# Altium schematic sheet IFCS-MAIN_V1.11_IFCS-MAIN_V1.1.schdoc
size 543 x 365 mm; Name: D:\【天成消防】\Altium Designer Ku\原理图模板\A1模板 -1.SchDot; Symbol: D:\【天成消防】\Altium Designer Ku\原理图模板\A1模板 -1.SchDot; Device: D:\【天成消防】\Altium Designer Ku\原理图模板\A1模板 -1.SchDot; Width: 2100; Height: 1400; X Region Count: 12; Y Region Count: 4; Blade Width: 30; Region Start: 1; Title Block Position: 3
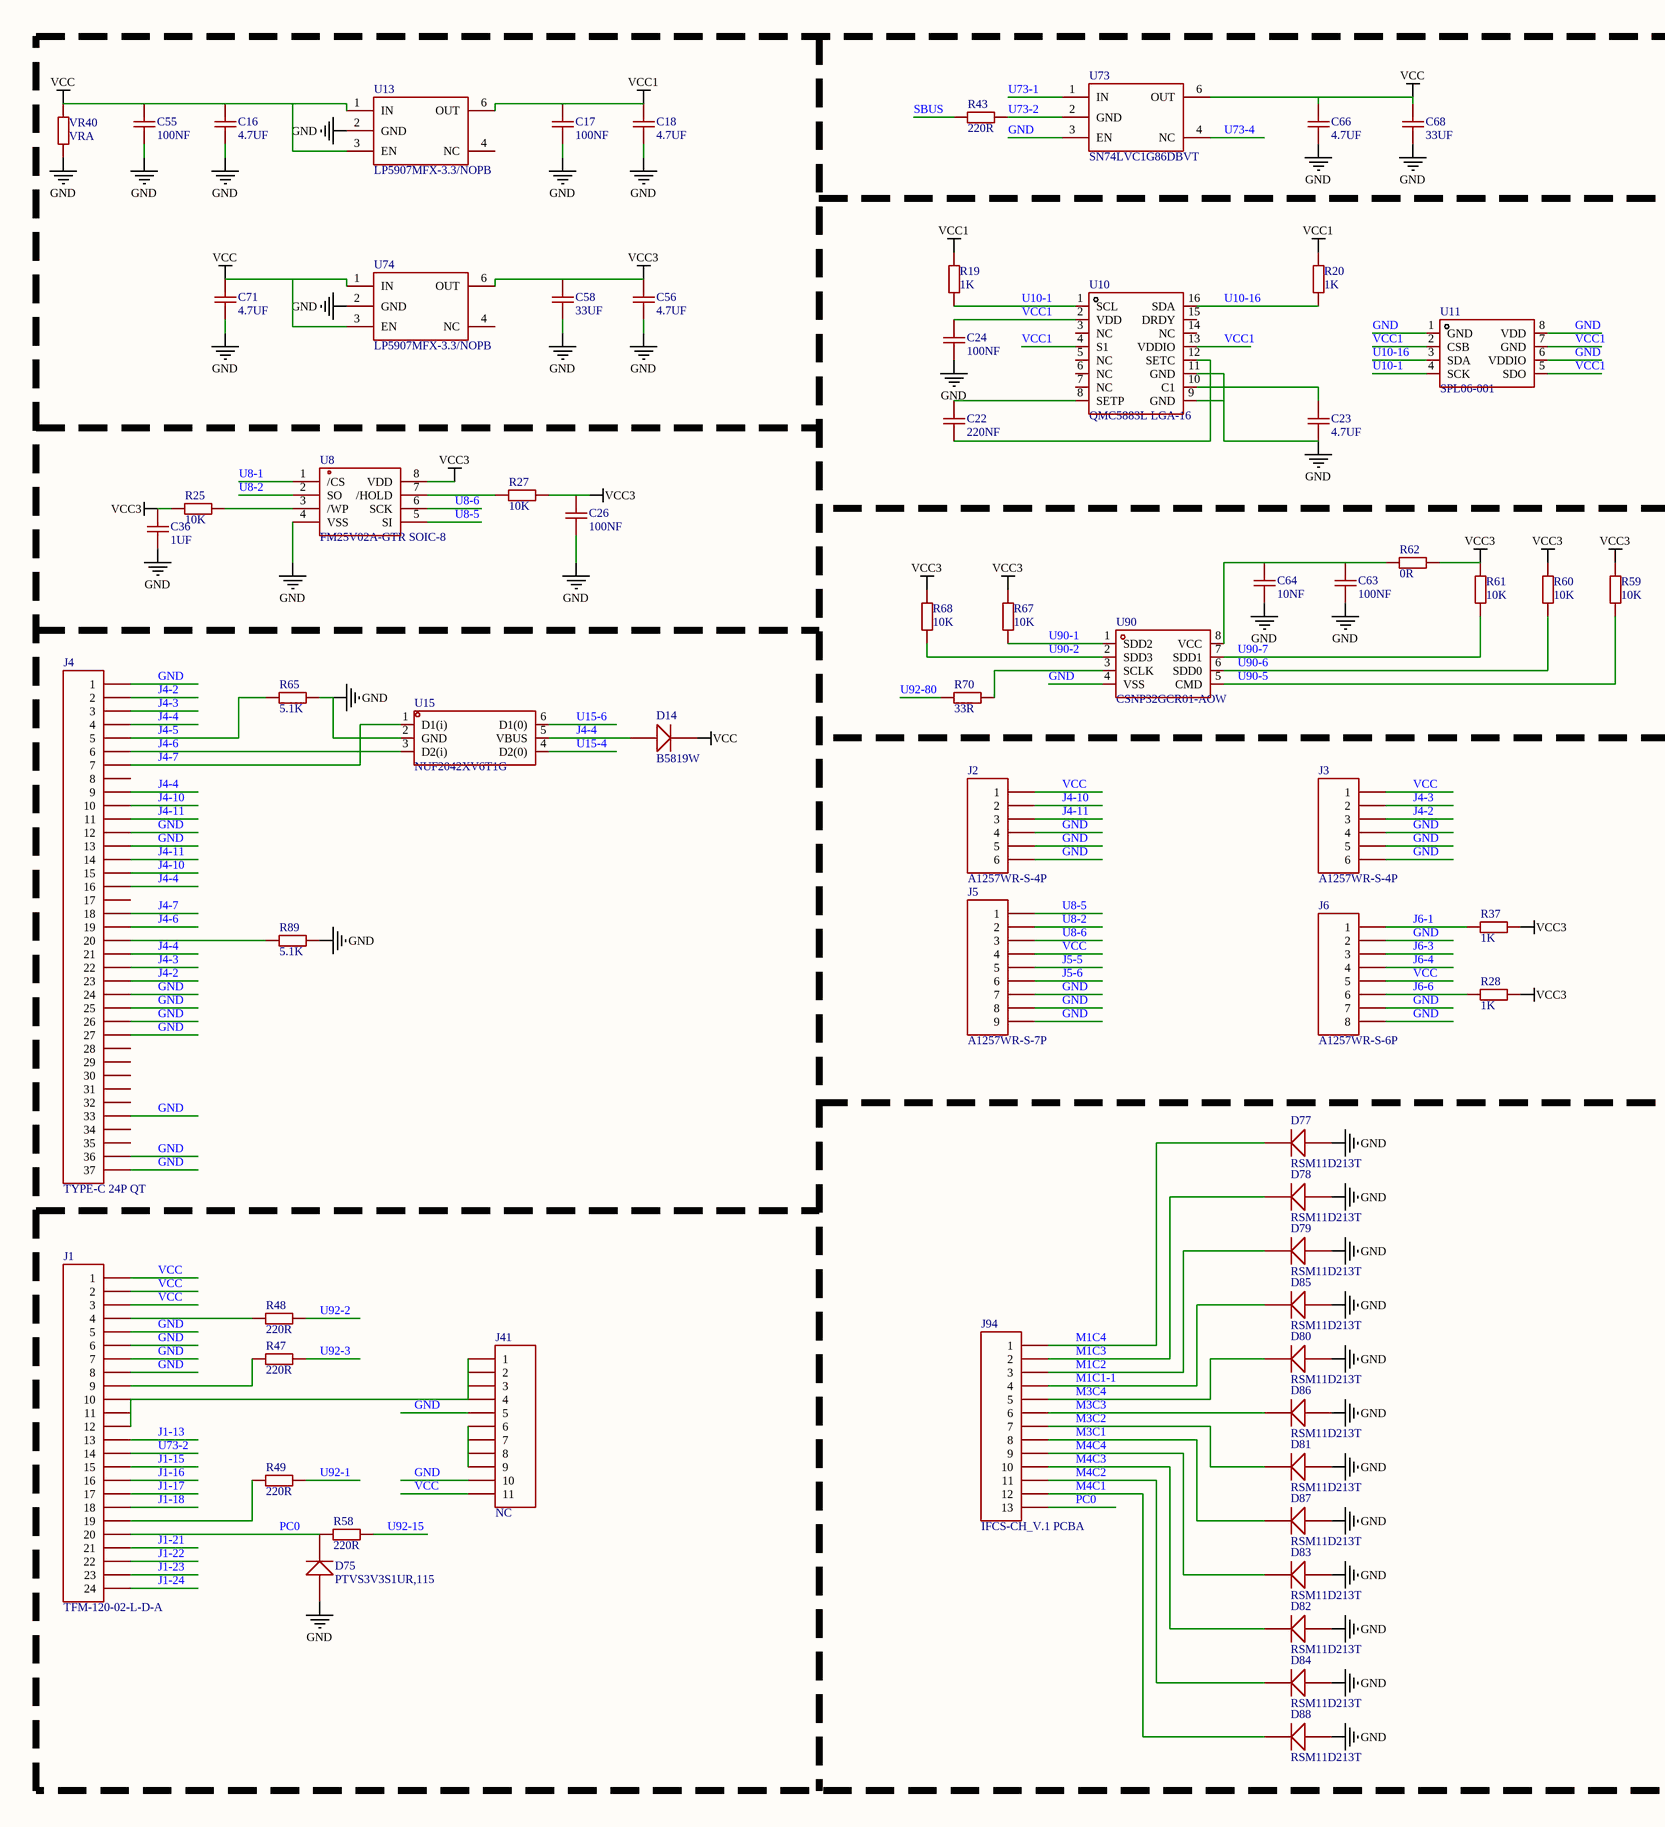
[diagram p0: IFCS-MAIN_V1.11_IFCS-MAIN_V1.1.schdoc, left]
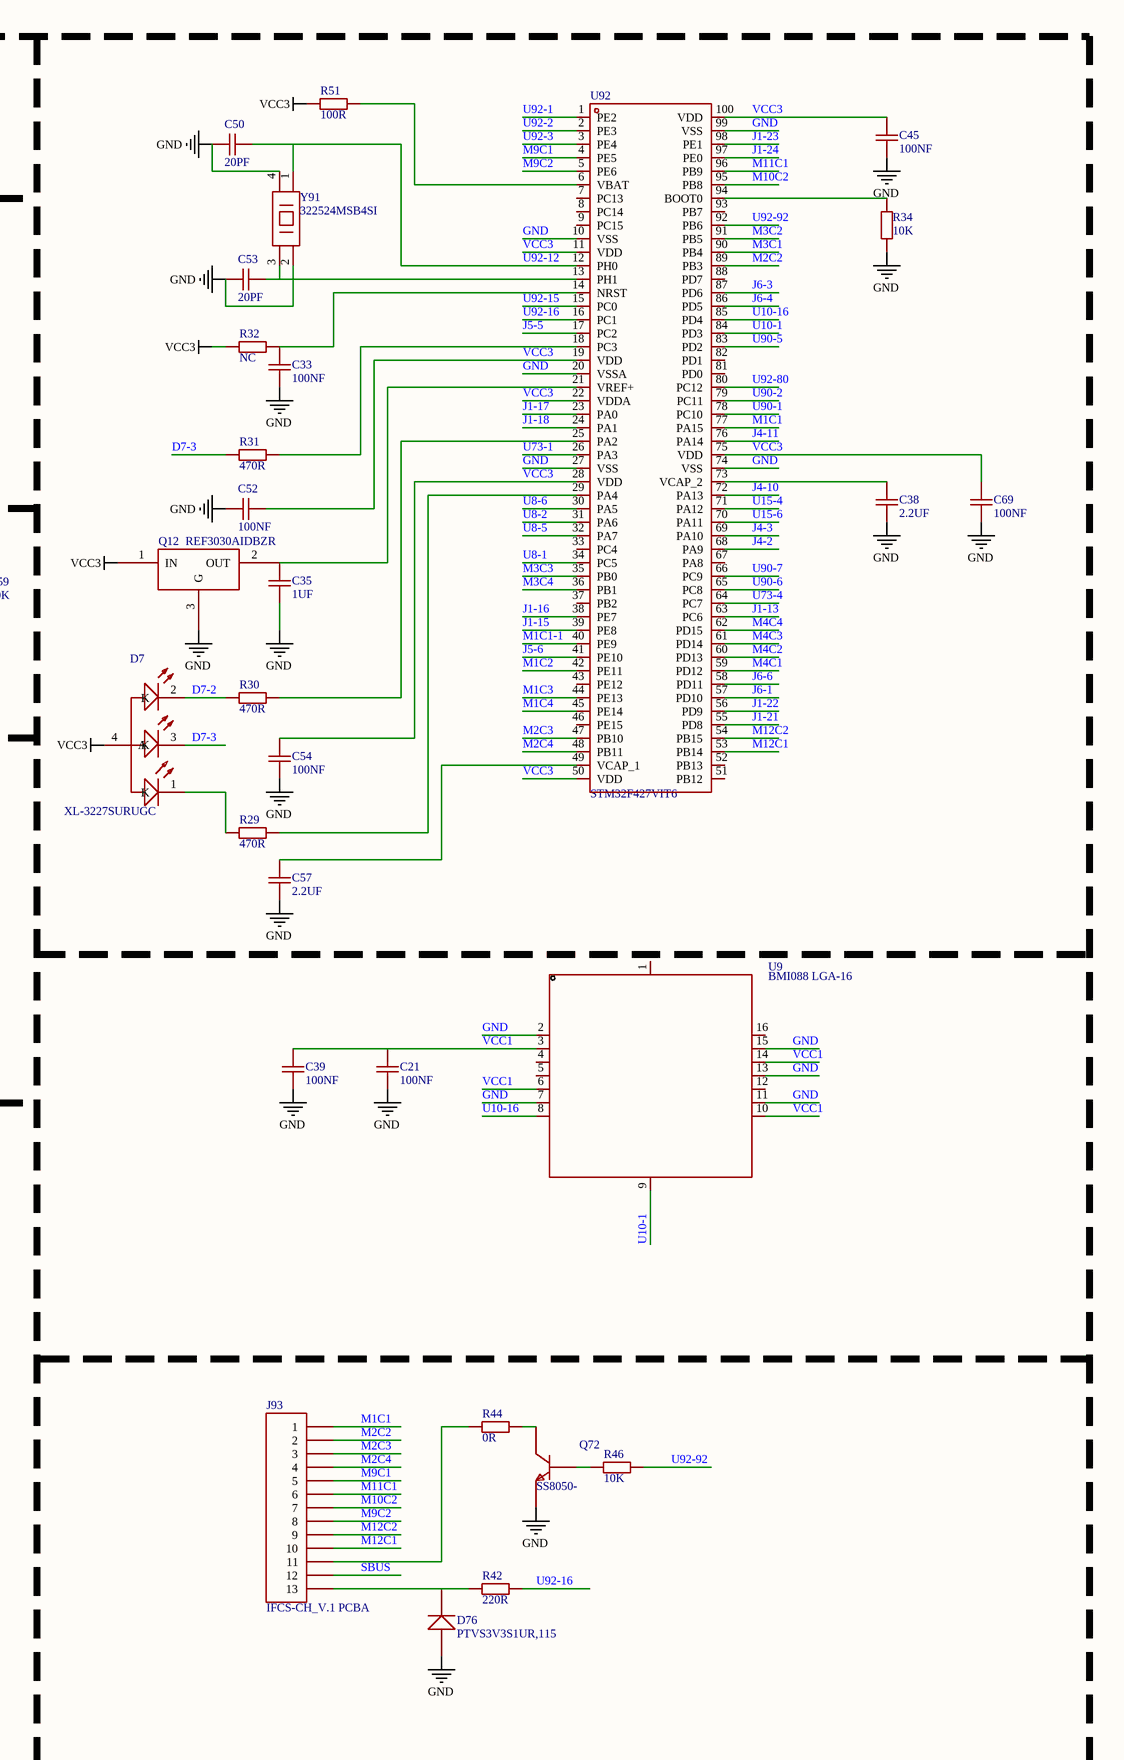
[diagram p1: IFCS-MAIN_V1.11_IFCS-MAIN_V1.1.schdoc, right]

## Parts
C16  4.7UF
C17  100NF
C18  4.7UF
C21  100NF
C22  220NF
C23  4.7UF
C24  100NF
C26  100NF
C33  100NF
C35  1UF
C36  1UF
C38  2.2UF
C39  100NF
C45  100NF
C50  20PF
C52  100NF
C53  20PF
C54  100NF
C55  100NF
C56  4.7UF
C57  2.2UF
C58  33UF
C63  100NF
C64  10NF
C66  4.7UF
C68  33UF
C69  100NF
C71  4.7UF
D7  XL-3227SURUGC
D14  B5819W
D75  PTVS3V3S1UR,115
D76  PTVS3V3S1UR,115
D77  RSM11D213T
D78  RSM11D213T
D79  RSM11D213T
D80  RSM11D213T
D81  RSM11D213T
D82  RSM11D213T
D83  RSM11D213T
D84  RSM11D213T
D85  RSM11D213T
D86  RSM11D213T
D87  RSM11D213T
D88  RSM11D213T
J1  TFM-120-02-L-D-A
J2  A1257WR-S-4P
J3  A1257WR-S-4P
J4  TYPE-C 24P QT
J5  A1257WR-S-7P
J6  A1257WR-S-6P
J41  NC
J93  IFCS-CH_V.1 PCBA
J94  IFCS-CH_V.1 PCBA
Q12  REF3030AIDBZR
Q72  SS8050-
R19  1K
R20  1K
R25  10K
R27  10K
R28  1K
R29  470R
R30  470R
R31  470R
R32  NC
R34  10K
R37  1K
R42  220R
R43  220R
R44  0R
R46  10K
R47  220R
R48  220R
R49  220R
R51  100R
R58  220R
R59  10K
R60  10K
R61  10K
R62  0R
R65  5.1K
R67  10K
R68  10K
R70  33R
R89  5.1K
U8  FM25V02A-GTR SOIC-8
U9  BMI088 LGA-16
U10  QMC5883L LGA-16
U11  SPL06-001
U13  LP5907MFX-3.3/NOPB
U15  NUF2042XV6T1G
U73  SN74LVC1G86DBVT
U74  LP5907MFX-3.3/NOPB
U90  CSNP32GCR01-AOW
U92  STM32F427VIT6
VR40  VRA
Y91  322524MSB4SI

## Nets
GND: C16.1 C17.2 C18.2 C21.2 C23.1 C24.2 C26.2 C33.2 C35.1 C36.1 C38.2 C39.1 C45.1 C50.1 C52.2 C53.1 C54.2 C55.2 C56.1 C57.2 C58.1 C63.2 C64.2 C66.2 C68.1 C69.1 C71.1 D75.1(A) D76.1(A) D77.1(A) D78.1(A) D79.1(A) D80.1(A) D81.1(A) D82.1(A) D83.1(A) D84.1(A) D85.1(A) D86.1(A) D87.1(A) D88.1(A) J1.5 J1.6 J1.7 J1.8 J2.4 J2.5 J2.6 J3.4 J3.5 J3.6 J4.1 J4.12 J4.13 J4.24 J4.25 J4.26 J4.27 J4.33 J4.36 J4.37 J5.7 J5.8 J5.9 J6.2 J6.7 J6.8 J41.5 J41.10 Q12.3(G) Q72.2(E) R34.2 R65.1 R89.2 U8.4(VSS) U9.2 U9.7 U9.11 U9.13 U9.15 U10.9(GND) U10.11(GND) U11.1(GND) U11.6(VDDIO) U11.8(VDD) U13.2(GND) U15.2(GND) U73.3(EN) U74.2(GND) U90.4(VSS) U92.10(VSS) U92.20(VSSA) U92.27(VSS) U92.74(VSS) U92.99(VSS) VR40.1 Y91.2 Y91.4
VCC: C16.2 C55.1 C66.1 C68.2 C71.2 D14.2(K) J1.1 J1.2 J1.3 J2.1 J3.1 J5.4 J6.5 J41.11 U13.1(IN) U13.3(EN) U73.6(OUT) U74.1(IN) U74.3(EN) VR40.2
VCC1: C17.1 C18.1 C21.1 C24.1 C39.2 R19.2 R20.2 U9.3 U9.6 U9.10 U9.14 U10.2(VDD) U10.4(S1) U10.13(VDDIO) U11.2(CSB) U11.5(SDO) U11.7(GND) U13.6(OUT)
VCC3: C26.1 C36.2 C45.2 C52.1 C54.1 C56.2 C58.2 C69.2 D7.4(A) Q12.1(IN) R25.1 R27.1 R28.2 R32.2 R37.2 R51.2 R59.2 R60.2 R61.2 R62.2 R67.1 R68.1 U8.8(VDD) U74.6(OUT) U92.11(VDD) U92.19(VDD) U92.22(VDDA) U92.28(VDD) U92.50(VDD) U92.75(VDD) U92.100(VDD)
D7-2: D7.2(K) R30.1
D7-3: D7.3(K) R31.1
J1-13: J1.13 U92.63(PC6)
J1-15: J1.15 U92.39(PE8)
J1-16: J1.16 U92.38(PE7)
J1-17: J1.17 U92.23(PA0)
J1-18: J1.18 U92.24(PA1)
J1-21: J1.21 U92.55(PD8)
J1-22: J1.22 U92.56(PD9)
J1-23: J1.23 U92.98(PE1)
J1-24: J1.24 U92.97(PE0)
J4-2: J3.3 J4.2 J4.23 U92.68(PA9)
J4-3: J3.2 J4.3 J4.22 U92.69(PA10)
J4-4: D14.1(A) J4.4 J4.9 J4.16 J4.21 U15.5(VBUS)
J4-5: J4.5 R65.2
J4-6: J4.6 J4.19 U15.3(D2(i))
J4-7: J4.7 J4.18 U15.1(D1(i))
J4-10: J2.2 J4.10 J4.15 U92.72(PA13)
J4-11: J2.3 J4.11 J4.14 U92.76(PA14)
J5-5: J5.5 U92.17(PC2)
J5-6: J5.6 U92.41(PE10)
J6-1: J6.1 R37.1 U92.57(PD10)
J6-3: J6.3 U92.87(PD6)
J6-4: J6.4 U92.86(PD5)
J6-6: J6.6 R28.1 U92.58(PD11)
M1C1: J93.1 U92.77(PA15)
M1C1-1: D85.2(K) J94.4 U92.40(PE9)
M1C2: D79.2(K) J94.3 U92.42(PE11)
M1C3: D78.2(K) J94.2 U92.44(PE13)
M1C4: D77.2(K) J94.1 U92.45(PE14)
M2C2: J93.2 U92.89(PB3)
M2C3: J93.3 U92.47(PB10)
M2C4: J93.4 U92.48(PB11)
M3C1: D87.2(K) J94.8 U92.90(PB4)
M3C2: D81.2(K) J94.7 U92.91(PB5)
M3C3: D86.2(K) J94.6 U92.35(PB0)
M3C4: D80.2(K) J94.5 U92.36(PB1)
M4C1: D88.2(K) J94.12 U92.59(PD12)
M4C2: D84.2(K) J94.11 U92.60(PD13)
M4C3: D82.2(K) J94.10 U92.61(PD14)
M4C4: D83.2(K) J94.9 U92.62(PD15)
M9C1: J93.5 U92.4(PE5)
M9C2: J93.8 U92.5(PE6)
M10C2: J93.7 U92.95(PB8)
M11C1: J93.6 U92.96(PB9)
M12C1: J93.10 U92.53(PB14)
M12C2: J93.9 U92.54(PB15)
PC0: D75.2(K) J1.20 J94.13 R58.2
SBUS: J93.12 R43.1
U8-1: U8.1(/CS) U92.34(PC5)
U8-2: J5.2 U8.2(SO) U92.31(PA6)
U8-5: J5.1 U8.5(SI) U92.32(PA7)
U8-6: J5.3 U8.6(SCK) U92.30(PA5)
U10-1: R19.1 U9.9 U10.1(SCL) U11.4(SCK) U92.84(PD3)
U10-16: R20.1 U9.8 U10.16(SDA) U11.3(SDA) U92.85(PD4)
U15-4: U15.4(D2(0)) U92.71(PA12)
U15-6: U15.6(D1(0)) U92.70(PA11)
U73-1: U73.1(IN) U92.26(PA3)
U73-2: J1.14 R43.2 U73.2(GND)
U73-4: U73.4(NC) U92.64(PC7)
U90-1: R67.2 U90.1(SDD2) U92.78(PC10)
U90-2: R68.2 U90.2(SDD3) U92.79(PC11)
U90-5: R59.1 U90.5(CMD) U92.83(PD2)
U90-6: R60.1 U90.6(SDD0) U92.65(PC8)
U90-7: R61.1 U90.7(SDD1) U92.66(PC9)
U92-1: R49.1 U92.1(PE2)
U92-2: R48.1 U92.2(PE3)
U92-3: R47.1 U92.3(PE4)
U92-12: C50.2 U92.12(PH0) Y91.1
U92-15: R58.1 U92.15(PC0)
U92-16: R42.2 U92.16(PC1)
U92-80: R70.2 U92.80(PC12)
U92-92: R46.2 U92.92(PB6)
NetC22_1: C22.1 U10.8(SETP)
NetC22_2: C22.2 U10.12(SETC)
NetC23_2: C23.2 U10.10(C1)
NetC33_1: C33.1 R32.1 U92.14(NRST)
NetC35_2: C35.2 Q12.2(OUT) U92.21(VREF+)
NetC38_1: C38.1 U92.73(VCAP_2)
NetC53_2: C53.2 U92.13(PH1) Y91.3
NetC57_1: C57.1 U92.49(VCAP_1)
NetC63_1: C63.1 C64.1 R62.1 U90.8(VCC)
NetD7_1: D7.1(K) R29.1
NetD76_2: D76.2(K) J93.13 R42.1
NetJ1_4: J1.4 R48.2
NetJ1_9: J1.9 R47.2
NetJ1_10: J1.10 J1.11 J1.12 J41.1 J41.2 J41.3 J41.4
NetJ1_19: J1.19 R49.2
NetJ4_20: J4.20 R89.1
NetJ41_6: J41.6 J41.7 J41.8 J41.9
NetJ93_11: J93.11 R44.1
NetQ72_1: Q72.1(B) R46.1
NetQ72_3: Q72.3(C) R44.2
NetR25_2: R25.2 U8.3(/WP)
NetR27_2: R27.2 U8.7(/HOLD)
NetR29_2: R29.2 U92.29(PA4)
NetR30_2: R30.2 U92.25(PA2)
NetR31_2: R31.2 U92.18(PC3)
NetR34_1: R34.1 U92.94(BOOT0)
NetR51_1: R51.1 U92.6(VBAT)
NetR70_1: R70.1 U90.3(SCLK)

Not connected (* = marked no-connect by the designer): J4 8 17 28 29 30 31 32 34 35; U9 1 4 5 12 16; U10 3(NC) 5(NC) 6(NC) 7(NC) 14(NC) 15(DRDY); U13 4(NC); U74 4(NC); U92 7(PC13) 8(PC14) 9(PC15) 33(PC4) 37(PB2) 43(PE12) 46(PE15) 51(PB12) 52(PB13) 67(PA8) 81(PD0) 82(PD1) 88(PD7) 93(PB7)

## Notes on the sheet
- 1
- 2
- 3
- 4
- 5
- 6
- 7
- 8
- 9
- 10
- 11
- 12
- A
- B
- C
- D

## Library data of the parts
C16 C18 C23 C56 C66 C71 = 4.7UF: Symbol: CAP-贴片电容; Origin Footprint 1: C0402; Origin Footprint 2: C0603; Origin Footprint 3: C0805; Origin Footprint 4: C1206; Origin Footprint 5: C1210; Origin Footprint 6: C1812; Origin Footprint 7: C2220; Origin Footprint 8: 0603; Add into BOM: yes; Device: 4.7UF; Convert to PCB: yes; Design Item ID: CAP-贴片电容; Library Name: 集成库_源
C17 C21 C24 C26 C33 C39 C45 C52 C54 C55 C63 C69 = 100NF: Symbol: CAP-贴片电容; Origin Footprint 1: C0402; Origin Footprint 2: C0603; Origin Footprint 3: C0805; Origin Footprint 4: C1206; Origin Footprint 5: C1210; Origin Footprint 6: C1812; Origin Footprint 7: C2220; Origin Footprint 8: 0603; Add into BOM: yes; Device: 100NF; Convert to PCB: yes; Design Item ID: CAP-贴片电容; Library Name: 集成库_源
C22 = 220NF: Symbol: CAP-贴片电容; Origin Footprint 1: C0402; Origin Footprint 2: C0603; Origin Footprint 3: C0805; Origin Footprint 4: C1206; Origin Footprint 5: C1210; Origin Footprint 6: C1812; Origin Footprint 7: C2220; Origin Footprint 8: 0603; Add into BOM: yes; Device: 220NF; Convert to PCB: yes; Design Item ID: CAP-贴片电容; Library Name: 集成库_源
C35 C36 = 1UF: Symbol: CAP-贴片电容; Origin Footprint 1: C0402; Origin Footprint 2: C0603; Origin Footprint 3: C0805; Origin Footprint 4: C1206; Origin Footprint 5: C1210; Origin Footprint 6: C1812; Origin Footprint 7: C2220; Origin Footprint 8: 0603; Add into BOM: yes; Device: 1UF; Convert to PCB: yes; Design Item ID: CAP-贴片电容; Library Name: 集成库_源
C38 C57 = 2.2UF: Symbol: CAP-贴片电容; Origin Footprint 1: C0402; Origin Footprint 2: C0603; Origin Footprint 3: C0805; Origin Footprint 4: C1206; Origin Footprint 5: C1210; Origin Footprint 6: C1812; Origin Footprint 7: C2220; Origin Footprint 8: 0603; Add into BOM: yes; Device: 2.2UF; Convert to PCB: yes; Design Item ID: CAP-贴片电容; Library Name: 集成库_源
C50 C53 = 20PF: Symbol: CAP-贴片电容; Origin Footprint 1: C0402; Origin Footprint 2: C0603; Origin Footprint 3: C0805; Origin Footprint 4: C1206; Origin Footprint 5: C1210; Origin Footprint 6: C1812; Origin Footprint 7: C2220; Origin Footprint 8: 0603; Add into BOM: yes; Device: 20PF; Convert to PCB: yes; Design Item ID: CAP-贴片电容; Library Name: 集成库_源
C58 C68 = 33UF: Symbol: CAP-贴片电容; Origin Footprint 1: C0402; Origin Footprint 2: C0603; Origin Footprint 3: C0805; Origin Footprint 4: C1206; Origin Footprint 5: C1210; Origin Footprint 6: C1812; Origin Footprint 7: C2220; Origin Footprint 8: 0603; Add into BOM: yes; Device: 33UF; Convert to PCB: yes; Design Item ID: CAP-贴片电容; Library Name: 集成库_源
C64 = 10NF: Symbol: CAP-贴片电容; Origin Footprint 1: C0402; Origin Footprint 2: C0603; Origin Footprint 3: C0805; Origin Footprint 4: C1206; Origin Footprint 5: C1210; Origin Footprint 6: C1812; Origin Footprint 7: C2220; Origin Footprint 8: 0603; Add into BOM: yes; Device: 10NF; Convert to PCB: yes; Design Item ID: CAP-贴片电容; Library Name: 集成库_源
D7 = XL-3227SURUGC: Symbol: LED1-RGB_1; Origin Footprint 1: LED-33; Add into BOM: yes; Origin Footprint: 6; Device: XL-3227SURUGC; Convert to PCB: yes; Design Item ID: LED1-RGB_1; Library Name: 集成库_源
D14 = B5819W: Symbol: Diode 1N4148; Origin Footprint 1: DO-35; Origin Footprint 2: MDIODE1; Origin Footprint 3: LL34; Add into BOM: yes; Device: B5819W; V 1_5: *; S03631B: *; Convert to PCB: yes; Design Item ID: Diode 1N4148; Library Name: 集成库_源; V 1.5: *
D75 D76 = PTVS3V3S1UR,115: Symbol: Diode 1N4148; Origin Footprint 1: DO-35; Origin Footprint 2: MDIODE1; Origin Footprint 3: LL34; Add into BOM: yes; Device: PTVS3V3S1UR,115; V 1_5: *; S03631B: *; Convert to PCB: yes; Design Item ID: Diode 1N4148; Library Name: 集成库_源; V 1.5: *
D77-D88 = RSM11D213T: Symbol: Diode 1N4148; Origin Footprint 1: DO-35; Origin Footprint 2: MDIODE1; Origin Footprint 3: LL34; Add into BOM: yes; Device: RSM11D213T; V 1_5: *; S03631B: *; Convert to PCB: yes; Design Item ID: Diode 1N4148; Library Name: 集成库_源; V 1.5: *
J1 = TFM-120-02-L-D-A: Symbol: HDR1X24; Origin Footprint 1: HDR2X11; Origin Footprint 2: HDR2X11H; Add into BOM: yes; Device: TFM-120-02-L-D-A; LatestRevisionDate: 17-Jul-2002; LatestRevisionNote: Re-released for DXP Platform.; Publisher: Altium Limited; Convert to PCB: yes; Design Item ID: HDR1X24; Library Name: 集成库_源
J2 J3 = A1257WR-S-4P: Symbol: HDR1X6; Origin Footprint 1: 2EDG-508-6H; Origin Footprint 2: 2EDG-508-6; Origin Footprint 4: HDR1X6H; Origin Footprint 5: MDR1X6; Origin Footprint 6: HDR2X3; Origin Footprint 7: HDR2X3H; Origin Footprint 8: KF128-5.0-6P; Origin Footprint 9: XH2.54-6; Origin Footprint 10: VH3.96-6; Origin Footprint 11: mhk2x2; Add into BOM: yes; Device: A1257WR-S-4P; LatestRevisionDate: 17-Jul-2002; LatestRevisionNote: Re-released for DXP Platform.; Publisher: Altium Limited; Origin Footprint 3: HDR1X6; Convert to PCB: yes; Design Item ID: HDR1X6; Library Name: 集成库_源
J4 = TYPE-C 24P QT: Symbol: HDR1X37; Origin Footprint 1: 1N4007; Add into BOM: yes; Origin Footprint: 3; Device: TYPE-C 24P QT; LatestRevisionDate: 17-Jul-2002; LatestRevisionNote: Re-released for DXP Platform.; Publisher: Altium Limited; Convert to PCB: yes; Design Item ID: HDR1X37; Library Name: 集成库_源
J5 = A1257WR-S-7P: Symbol: HDR1X9; Origin Footprint 3: HDR1X9H; Origin Footprint 4: MDR1X9; Origin Footprint 5: RES-9PIN; Origin Footprint 6: KF58R-9; Add into BOM: yes; Device: A1257WR-S-7P; LatestRevisionDate: 17-Jul-2002; LatestRevisionNote: Re-released for DXP Platform.; Publisher: Altium Limited; Origin Footprint 1: HDR1X9; Origin Footprint 2: HDR1X9; Convert to PCB: yes; Design Item ID: HDR1X9; Library Name: 集成库_源
J6 = A1257WR-S-6P: Symbol: HDR1X8; Origin Footprint 1: 2EDG-508-8H; Origin Footprint 2: 2EDG-508-8; Origin Footprint 4: HDR1X8H; Origin Footprint 5: HDR2X4; Origin Footprint 6: HDR2X4H; Origin Footprint 7: KF128-5.0-8P; Origin Footprint 8: MDR1X8; Origin Footprint 9: MDR2X4; Origin Footprint 10: XH2.54-8; Origin Footprint 11: KF58R-8; Origin Footprint 12: KF78R-8; Add into BOM: yes; Device: A1257WR-S-6P; LatestRevisionDate: 17-Jul-2002; LatestRevisionNote: Re-released for DXP Platform.; Publisher: Altium Limited; Origin Footprint 3: HDR1X8; Convert to PCB: yes; Design Item ID: HDR1X8; Library Name: 集成库_源
J41 = NC: Symbol: HDR1X11; Origin Footprint 2: HDR1X11H; Add into BOM: yes; Device: NC; LatestRevisionDate: 17-Jul-2002; LatestRevisionNote: Re-released for DXP Platform.; Publisher: Altium Limited; Origin Footprint 1: HDR1X11; Convert to PCB: yes; Design Item ID: HDR1X11; Library Name: 集成库_源
J93 J94 = IFCS-CH_V.1 PCBA: Symbol: HDR1X13; Origin Footprint 1: HDR1X13H; Add into BOM: yes; Device: IFCS-CH_V.1 PCBA; LatestRevisionDate: 17-Jul-2002; LatestRevisionNote: Re-released for DXP Platform.; Publisher: Altium Limited; Origin Footprint 2: HDR1X13; Convert to PCB: yes; Design Item ID: HDR1X13; Library Name: 集成库_源
Q12 = REF3030AIDBZR: Symbol: LM1117; Origin Footprint 1: SOT-89; Add into BOM: yes; Origin Footprint: 11; Device: REF3030AIDBZR; Convert to PCB: yes; Design Item ID: LM1117; Library Name: 集成库_源
Q72 = SS8050-: Symbol: NPN; Origin Footprint 1: SOT23-3; Origin Footprint 2: SOT23-3-2; Origin Footprint 3: SOT-89; Origin Footprint 4: TO-92A-123; Origin Footprint 5: TO-92A-213; Origin Footprint 6: TO-92B-123; Origin Footprint 7: TO-92B-213; Add into BOM: yes; Device: SS8050-; Convert to PCB: yes; Design Item ID: NPN; Library Name: 集成库_源
R19 R20 R28 R37 = 1K: Symbol: RES-贴片电阻; Origin Footprint 1: R0402; Origin Footprint 2: R0603; Origin Footprint 3: R0805; Origin Footprint 4: R1206; Origin Footprint 5: R1210; Origin Footprint 6: R1808; Origin Footprint 7: R1812; Origin Footprint 8: R2512; Origin Footprint 9: 0603; Add into BOM: yes; Device: 1K; Convert to PCB: yes; Design Item ID: RES-贴片电阻; Library Name: 集成库_源
R25 R27 R34 R46 R59-R61 R67 R68 = 10K: Symbol: RES-贴片电阻; Origin Footprint 1: R0402; Origin Footprint 2: R0603; Origin Footprint 3: R0805; Origin Footprint 4: R1206; Origin Footprint 5: R1210; Origin Footprint 6: R1808; Origin Footprint 7: R1812; Origin Footprint 8: R2512; Origin Footprint 9: 0603; Add into BOM: yes; Device: 10K; Convert to PCB: yes; Design Item ID: RES-贴片电阻; Library Name: 集成库_源
R29-R31 = 470R: Symbol: RES-贴片电阻; Origin Footprint 1: R0402; Origin Footprint 2: R0603; Origin Footprint 3: R0805; Origin Footprint 4: R1206; Origin Footprint 5: R1210; Origin Footprint 6: R1808; Origin Footprint 7: R1812; Origin Footprint 8: R2512; Origin Footprint 9: 0603; Add into BOM: yes; Device: 470R; Convert to PCB: yes; Design Item ID: RES-贴片电阻; Library Name: 集成库_源
R32 = NC: Symbol: RES-贴片电阻; Origin Footprint 1: R0402; Origin Footprint 2: R0603; Origin Footprint 3: R0805; Origin Footprint 4: R1206; Origin Footprint 5: R1210; Origin Footprint 6: R1808; Origin Footprint 7: R1812; Origin Footprint 8: R2512; Origin Footprint 9: 0603; Add into BOM: yes; Device: NC; Convert to PCB: yes; Design Item ID: RES-贴片电阻; Library Name: 集成库_源
R42 R43 R47-R49 R58 = 220R: Symbol: RES-贴片电阻; Origin Footprint 1: R0402; Origin Footprint 2: R0603; Origin Footprint 3: R0805; Origin Footprint 4: R1206; Origin Footprint 5: R1210; Origin Footprint 6: R1808; Origin Footprint 7: R1812; Origin Footprint 8: R2512; Origin Footprint 9: 0603; Add into BOM: yes; Device: 220R; Convert to PCB: yes; Design Item ID: RES-贴片电阻; Library Name: 集成库_源
R44 R62 = 0R: Symbol: RES-贴片电阻; Origin Footprint 1: R0402; Origin Footprint 2: R0603; Origin Footprint 3: R0805; Origin Footprint 4: R1206; Origin Footprint 5: R1210; Origin Footprint 6: R1808; Origin Footprint 7: R1812; Origin Footprint 8: R2512; Origin Footprint 9: 0603; Add into BOM: yes; Device: 0R; Convert to PCB: yes; Design Item ID: RES-贴片电阻; Library Name: 集成库_源
R51 = 100R: Symbol: RES-贴片电阻; Origin Footprint 1: R0402; Origin Footprint 2: R0603; Origin Footprint 3: R0805; Origin Footprint 4: R1206; Origin Footprint 5: R1210; Origin Footprint 6: R1808; Origin Footprint 7: R1812; Origin Footprint 8: R2512; Origin Footprint 9: 0603; Add into BOM: yes; Device: 100R; Convert to PCB: yes; Design Item ID: RES-贴片电阻; Library Name: 集成库_源
R65 R89 = 5.1K: Symbol: RES-贴片电阻; Origin Footprint 1: R0402; Origin Footprint 2: R0603; Origin Footprint 3: R0805; Origin Footprint 4: R1206; Origin Footprint 5: R1210; Origin Footprint 6: R1808; Origin Footprint 7: R1812; Origin Footprint 8: R2512; Origin Footprint 9: 0603; Add into BOM: yes; Device: 5.1K; Convert to PCB: yes; Design Item ID: RES-贴片电阻; Library Name: 集成库_源
R70 = 33R: Symbol: RES-贴片电阻; Origin Footprint 1: R0402; Origin Footprint 2: R0603; Origin Footprint 3: R0805; Origin Footprint 4: R1206; Origin Footprint 5: R1210; Origin Footprint 6: R1808; Origin Footprint 7: R1812; Origin Footprint 8: R2512; Origin Footprint 9: 0603; Add into BOM: yes; Device: 33R; Convert to PCB: yes; Design Item ID: RES-贴片电阻; Library Name: 集成库_源
U8 = FM25V02A-GTR SOIC-8: Manufacturer: Infineon/CYPRESS(赛普拉斯); Add into BOM: yes; Interface Type: SPI; Memory Size: 256Kbit; Supply Voltage: 2V~3.6V; Supply Current: 2.5mA; Clock Frequency (fc): 40MHz; Standby supply current (Isb): 150uA; Sleep mode current (Izz): 8uA; Origin Footprint 1: SOIC-8_L5.0-W4.0-P1.27-LS6.0-BL; Origin Footprint: 7; Symbol: FM25V02A-GTR; Device: FM25V02A-GTR SOIC-8; LCSC Part Name: FM25V02A-GTR; Supplier Part: C66029; Manufacturer Part: FM25V02A-GTR; Supplier Footprint: SOIC-8; JLCPCB Part Class: Extended Part; Datasheet: https://atta.szlcsc.com/upload/public/pdf/source/20151225/1457707656054.pdf; Supplier: LCSC; Convert to PCB: yes; Operating Temperature: -40℃~+85℃; Design Item ID: FM25V02A-GTR
U9 = BMI088 LGA-16: Manufacturer: Bosch(博世); Add into BOM: yes; Sensor Type: 加速度计陀螺仪; Origin Footprint 1: LGA-16_L4.5-W3.0-P0.50-BL; Origin Footprint: 18; Symbol: BMI088; Device: BMI088 LGA-16; LCSC Part Name: BMI088; Supplier Part: C194919; Manufacturer Part: BMI088; Supplier Footprint: LGA-16(3x4.5); JLCPCB Part Class: Extended Part; Datasheet: https://atta.szlcsc.com/upload/public/pdf/source/20180628/C194919_66CCF125FF968C218A4D358C68AC68D6.pdf; Supplier: LCSC; Convert to PCB: yes; Operating Temperature: -40℃~+85℃; Design Item ID: BMI088
U10 = QMC5883L LGA-16: Manufacturer: QST(上海矽睿); Add into BOM: yes; Origin Footprint 1: LGA-16_L3.0-W3.0-P0.50-BL_SQ; Origin Footprint: 9; Symbol: QMC5883L; Device: QMC5883L LGA-16; LCSC Part Name: 三轴磁传感器 停产; Supplier Part: C976032; Manufacturer Part: QMC5883L; Supplier Footprint: LGA-16(3x3); JLCPCB Part Class: Extended Part; Datasheet: https://atta.szlcsc.com/upload/public/pdf/source/20201217/C976032_5B9A2F3901E175046CBA037B1F18A1F2.pdf; Supplier: LCSC; Convert to PCB: yes; Design Item ID: QMC5883L
U11 = SPL06-001: Manufacturer: Goertek(歌尔); Symbol: SPL06-001_C2684428; Add into BOM: yes; Origin Footprint 1: SENSOR-SMD_SPL06-001; Origin Footprint: 10; Device: SPL06-001; LCSC Part Name: 普通气压传感器 停产; Supplier Part: C2684428; Manufacturer Part: SPL06-001; Supplier Footprint: LGA-8(2x2.5); JLCPCB Part Class: Extended Part; Datasheet: https://atta.szlcsc.com/upload/public/pdf/source/20210120/C2684428_7EA58BBCA3793458F617124FBE4BF8F1.pdf; Supplier: LCSC; Convert to PCB: yes; Operating Temperature: -40℃~+85℃; Design Item ID: SPL06-001_C2684428
U13 U74 = LP5907MFX-3.3/NOPB: Symbol: SOP-5透明; Origin Footprint 1: DIP-8; Add into BOM: yes; Origin Footprint: 12; Device: LP5907MFX-3.3/NOPB; Convert to PCB: yes; Design Item ID: SOP-5透明; Library Name: 集成库_源
U15 = NUF2042XV6T1G: Manufacturer: onsemi(安森美); Add into BOM: yes; Filter Order: 2; Value: 42pF; ESD Protection: 有; Origin Footprint 1: SOT-563_L1.6-W1.2-P0.50-LS1.6-TL; Origin Footprint: 14; Symbol: NUF2042XV6T1G; Device: NUF2042XV6T1G; LCSC Part Name: NUF2042XV6T1G; Supplier Part: C90707; Manufacturer Part: NUF2042XV6T1G; Supplier Footprint: SOT-563; JLCPCB Part Class: Extended Part; Datasheet: https://atta.szlcsc.com/upload/public/pdf/source/20221020/EA5241A61CFA6E196F125BE50C842EA7.pdf; Supplier: LCSC; Convert to PCB: yes; Number of Channels: 2; OperatingTemperature: -55℃~+125℃; Design Item ID: NUF2042XV6T1G
U73 = SN74LVC1G86DBVT: Symbol: SOP-5透明; Origin Footprint 1: DIP-8; Add into BOM: yes; Origin Footprint: 12; Device: SN74LVC1G86DBVT; Convert to PCB: yes; Design Item ID: SOP-5透明; Library Name: 集成库_源
U90 = CSNP32GCR01-AOW: Manufacturer: CS(创世); Add into BOM: yes; Memory Size: 32Gbit; Clock Frequency: 50MHz; Voltage - Supply: 2.7V~3.6V; Interface: SD / SPI; Origin Footprint 1: LGA-8_L8.0-W6.2-TL; Origin Footprint: 20; Symbol: CSNP32GCR01-AOW; Device: CSNP32GCR01-AOW; LCSC Part Name: CSGen2 SDNAND 32Gb 小尺寸 高可靠性; Supplier Part: C2841139; Manufacturer Part: CSNP32GCR01-AOW; Supplier Footprint: LGA-8(6.2x8); JLCPCB Part Class: Extended Part; Datasheet: https://atta.szlcsc.com/upload/public/pdf/source/20210628/C2841139_770BD785495677B0240BDE699CBAC374.pdf; Supplier: LCSC; Convert to PCB: yes; Operating Temperature: -; Design Item ID: CSNP32GCR01-AOW
U92 = STM32F427VIT6: Manufacturer: ST(意法半导体); Symbol: STM32F427VIT6TR; Add into BOM: yes; CPU Core: ARM-M4; CPU Maximum Speed: 180MHz; Program Storage Size: 2MB; Number of I/O: 82; ADC (Bit): 12bit; Low Voltage Detection Threshold: 1.8V~3.6V; Origin Footprint 1: LQFP-100_L14.0-W14.0-P0.50-LS16.0-BL; Origin Footprint: 22; Device: STM32F427VIT6; LCSC Part Name: 带DSP和FPU的高性能高级系列ARM Cortex-M4 MCU，具有2 MB Flash、180 MHz CPU、ART加速器、Chrom-ART加速器和FSMC; Supplier Part: C2969845; Manufacturer Part: STM32F427VIT6TR; Supplier Footprint: LQFP-100(14x14); JLCPCB Part Class: Extended Part; Datasheet: https://atta.szlcsc.com/upload/public/pdf/source/20171120/C75389_15111748895051131877.pdf; Supplier: LCSC; Convert to PCB: yes; DAC (Bit): 12bit; Application Area: -; Design Item ID: STM32F427VIT6TR
VR40 = VRA: Symbol: RES-贴片电阻; Origin Footprint 1: R0402; Origin Footprint 2: R0603; Origin Footprint 3: R0805; Origin Footprint 4: R1206; Origin Footprint 5: R1210; Origin Footprint 6: R1808; Origin Footprint 7: R1812; Origin Footprint 8: R2512; Origin Footprint 9: 0603; Add into BOM: yes; Device: VRA; Convert to PCB: yes; Design Item ID: RES-贴片电阻; Library Name: 集成库_源
Y91 = 322524MSB4SI: Symbol: XTAL1_1; Add into BOM: yes; Device: 322524MSB4SI; Origin Footprint 1: XTAL-3225; Origin Footprint 2: XTAL-5032; Origin Footprint 3: XTAL-5070; Origin Footprint 4: XTAL-7015; Origin Footprint 5: XTAL-7050; Convert to PCB: yes; Design Item ID: XTAL1_1; Library Name: 集成库_源